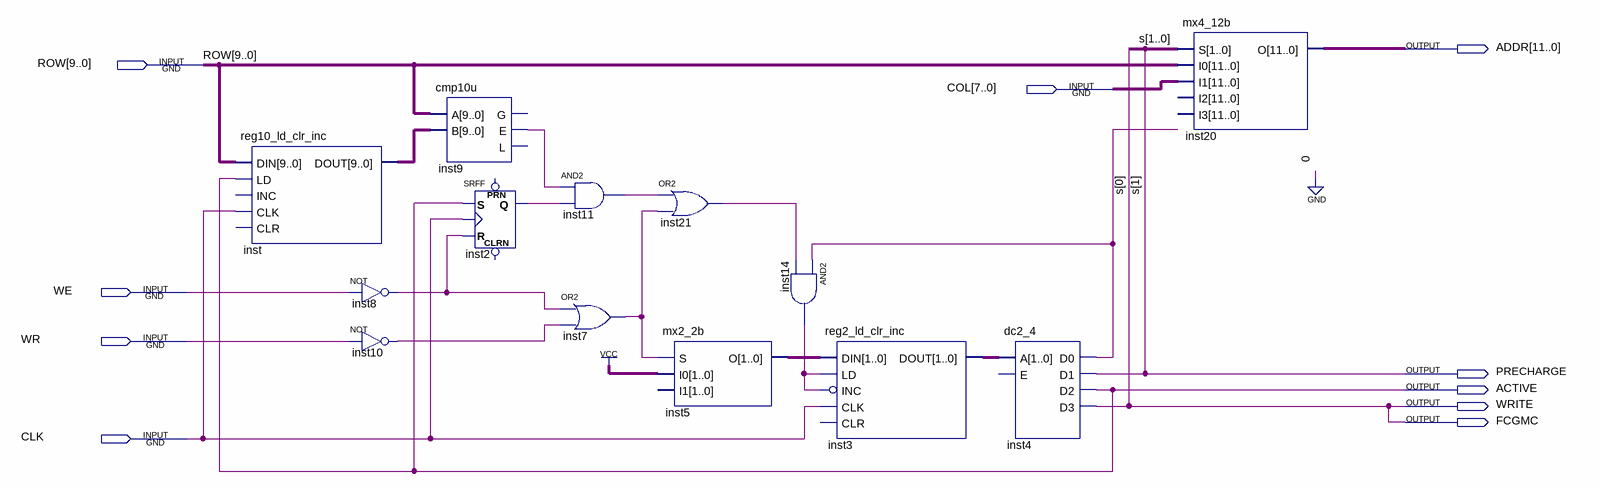
[diagram p0: schematic sheet]
// Quartus schematic wtcb.bdf as structural Verilog: 13 symbols, 10 pins
module wtcb (
  input  [9:0] ROW,
  input  [7:0] COL,
  input  WE,
  input  WR,
  input  CLK,
  output [11:0] ADDR,
  output PRECHARGE,
  output ACTIVE,
  output WRITE,
  output FCGMC
);

  wire inst2_q, inst4_d0, inst7_out, inst8_out, inst9_e, inst10_out, inst11_out, inst14_out, inst21_out;
  wire [1:0] inst3_dout, inst5_o;
  wire [9:0] inst_dout;

  reg10_ld_clr_inc inst (.DIN(ROW), .LD(ACTIVE), .CLK(CLK), .DOUT(inst_dout));  // open: INC, CLR
  not inst8 (inst8_out, WE);
  not inst10 (inst10_out, WR);
  cmp10u inst9 (.A(ROW), .B(inst_dout), .E(inst9_e));  // open: G, L
  SRFF inst2 (.S(ACTIVE), .R(inst8_out), .CLK(CLK), .Q(inst2_q));  // open: PRN, CLRN
  and inst11 (inst11_out, inst9_e, inst2_q);
  or inst7 (inst7_out, inst8_out, inst10_out);
  or inst21 (inst21_out, inst11_out, inst7_out);
  mx2_2b inst5 (.S(inst7_out), .I0(2'b11), .O(inst5_o));  // open: I1
  and inst14 (inst14_out, inst4_d0, inst21_out);
  reg2_ld_clr_inc inst3 (.CLK(CLK), .DIN(inst5_o), .INC(~inst14_out), .LD(inst14_out), .DOUT(inst3_dout));  // open: CLR
  dc2_4 inst4 (.A(inst3_dout), .D0(inst4_d0), .D1(PRECHARGE), .D2(ACTIVE), .D3(FCGMC));  // open: E
  mx4_12b inst20 (.S({PRECHARGE, FCGMC}), .I0({2'b00, ROW}), .I1({4'b0000, COL}), .O(ADDR));  // open: I2, I3

  assign WRITE = FCGMC;

  // Other names for the same wires on the sheet: s[1:0] = {PRECHARGE, FCGMC}
endmodule
